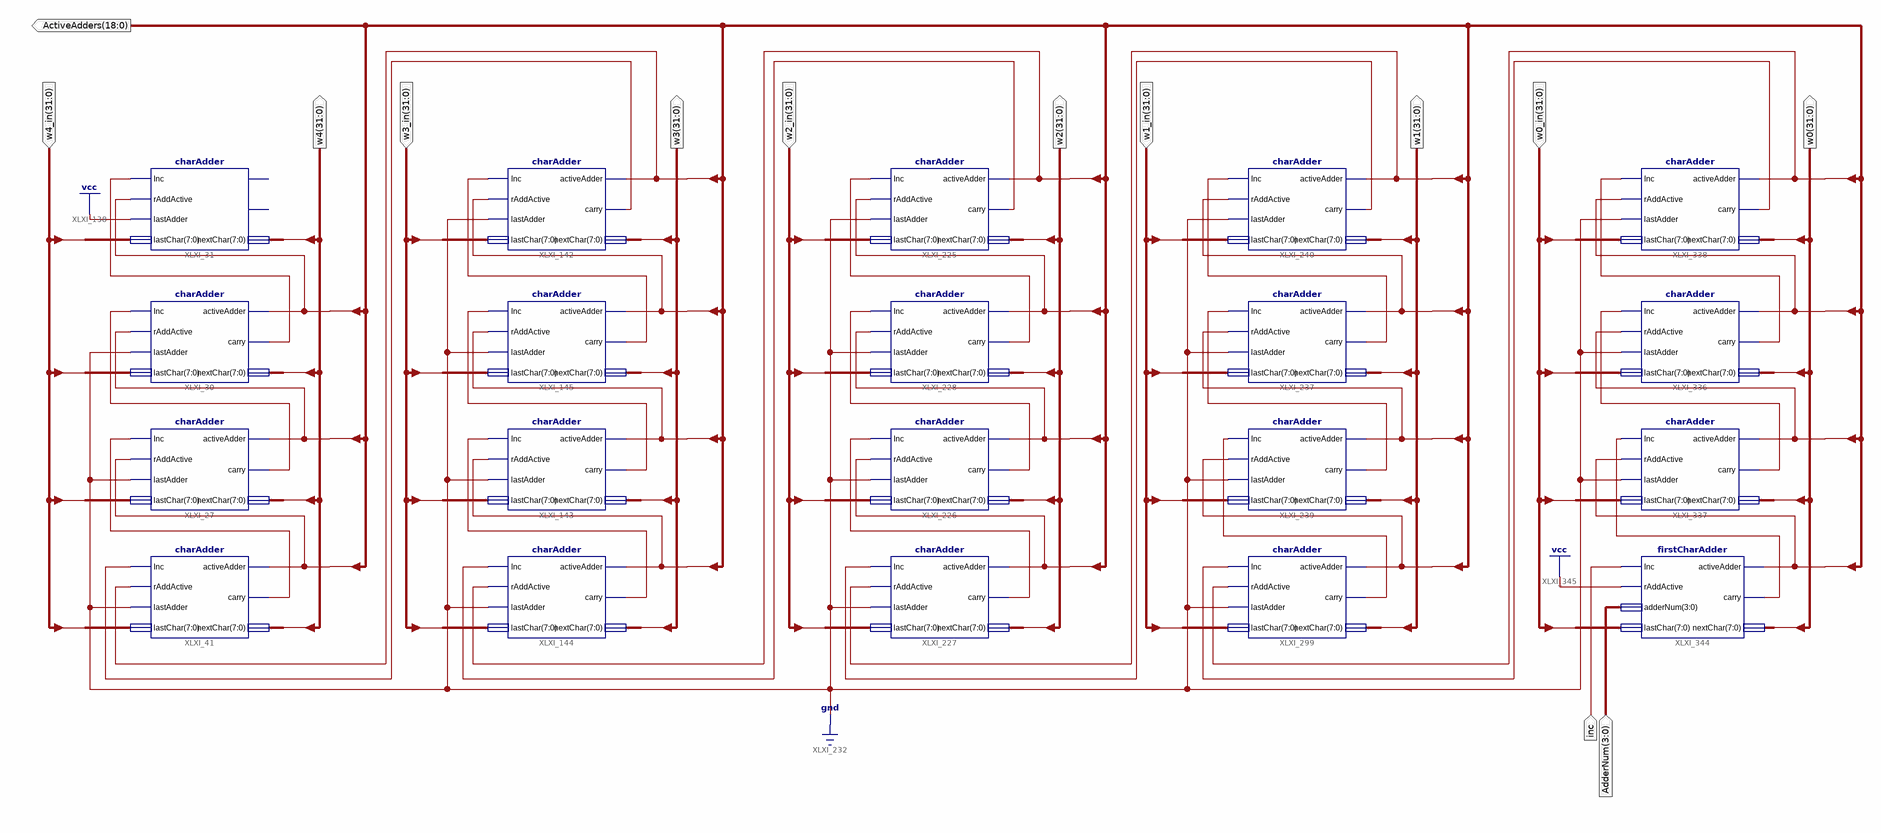
[diagram p0: schematic sheet 1]
// Xilinx ISE schematic bruteforce.sch (spartan3a) as structural Verilog: 20 symbols, 13 ports
module bruteforce (
  input  [31:0] w4_in,
  input  [31:0] w3_in,
  input  [31:0] w2_in,
  input  [31:0] w1_in,
  input  [31:0] w0_in,
  input  inc,
  input  [3:0] AdderNum,
  output [31:0] w4,
  output [31:0] w3,
  output [31:0] w2,
  output [31:0] w1,
  output [31:0] w0,
  output [18:0] ActiveAdders
);

  wire XLXN_10, XLXN_12, XLXN_14, XLXN_38, XLXN_39, XLXN_40, XLXN_168, XLXN_169, XLXN_170, XLXN_191,
       XLXN_192, XLXN_193, XLXN_249, XLXN_251, XLXN_253, XLXN_554, XLXN_555, XLXN_556, XLXN_582;

  charAdder XLXI_31 (
    .Inc(XLXN_10), .rAddActive(ActiveAdders[18]), .lastAdder(1'b1), .lastChar(w4_in[31:24]),
    .nextChar(w4[31:24]));  // open: activeAdder, carry
  charAdder XLXI_27 (
    .Inc(XLXN_14), .rAddActive(ActiveAdders[16]), .lastAdder(1'b0), .lastChar(w4_in[15:8]),
    .activeAdder(ActiveAdders[17]), .carry(XLXN_12), .nextChar(w4[15:8]));
  charAdder XLXI_41 (
    .Inc(XLXN_249), .rAddActive(ActiveAdders[15]), .lastAdder(1'b0), .lastChar(w4_in[7:0]),
    .activeAdder(ActiveAdders[16]), .carry(XLXN_14), .nextChar(w4[7:0]));
  charAdder XLXI_30 (
    .Inc(XLXN_12), .rAddActive(ActiveAdders[17]), .lastAdder(1'b0), .lastChar(w4_in[23:16]),
    .activeAdder(ActiveAdders[18]), .carry(XLXN_10), .nextChar(w4[23:16]));
  charAdder XLXI_145 (
    .Inc(XLXN_39), .rAddActive(ActiveAdders[13]), .lastAdder(1'b0), .lastChar(w3_in[23:16]),
    .activeAdder(ActiveAdders[14]), .carry(XLXN_38), .nextChar(w3[23:16]));
  charAdder XLXI_144 (
    .Inc(XLXN_251), .rAddActive(ActiveAdders[11]), .lastAdder(1'b0), .lastChar(w3_in[7:0]),
    .activeAdder(ActiveAdders[12]), .carry(XLXN_40), .nextChar(w3[7:0]));
  charAdder XLXI_143 (
    .Inc(XLXN_40), .rAddActive(ActiveAdders[12]), .lastAdder(1'b0), .lastChar(w3_in[15:8]),
    .activeAdder(ActiveAdders[13]), .carry(XLXN_39), .nextChar(w3[15:8]));
  charAdder XLXI_142 (
    .Inc(XLXN_38), .rAddActive(ActiveAdders[14]), .lastAdder(1'b0), .lastChar(w3_in[31:24]),
    .activeAdder(ActiveAdders[15]), .carry(XLXN_249), .nextChar(w3[31:24]));
  charAdder XLXI_225 (
    .Inc(XLXN_168), .rAddActive(ActiveAdders[10]), .lastAdder(1'b0), .lastChar(w2_in[31:24]),
    .activeAdder(ActiveAdders[11]), .carry(XLXN_251), .nextChar(w2[31:24]));
  charAdder XLXI_226 (
    .Inc(XLXN_170), .rAddActive(ActiveAdders[8]), .lastAdder(1'b0), .lastChar(w2_in[15:8]),
    .activeAdder(ActiveAdders[9]), .carry(XLXN_169), .nextChar(w2[15:8]));
  charAdder XLXI_227 (
    .Inc(XLXN_253), .rAddActive(ActiveAdders[7]), .lastAdder(1'b0), .lastChar(w2_in[7:0]),
    .activeAdder(ActiveAdders[8]), .carry(XLXN_170), .nextChar(w2[7:0]));
  charAdder XLXI_228 (
    .Inc(XLXN_169), .rAddActive(ActiveAdders[9]), .lastAdder(1'b0), .lastChar(w2_in[23:16]),
    .activeAdder(ActiveAdders[10]), .carry(XLXN_168), .nextChar(w2[23:16]));
  charAdder XLXI_237 (
    .Inc(XLXN_192), .rAddActive(ActiveAdders[5]), .lastAdder(1'b0), .lastChar(w1_in[23:16]),
    .activeAdder(ActiveAdders[6]), .carry(XLXN_193), .nextChar(w1[23:16]));
  charAdder XLXI_239 (
    .Inc(XLXN_191), .rAddActive(ActiveAdders[4]), .lastAdder(1'b0), .lastChar(w1_in[15:8]),
    .activeAdder(ActiveAdders[5]), .carry(XLXN_192), .nextChar(w1[15:8]));
  charAdder XLXI_240 (
    .Inc(XLXN_193), .rAddActive(ActiveAdders[6]), .lastAdder(1'b0), .lastChar(w1_in[31:24]),
    .activeAdder(ActiveAdders[7]), .carry(XLXN_253), .nextChar(w1[31:24]));
  charAdder XLXI_299 (
    .Inc(XLXN_582), .rAddActive(ActiveAdders[3]), .lastAdder(1'b0), .lastChar(w1_in[7:0]),
    .activeAdder(ActiveAdders[4]), .carry(XLXN_191), .nextChar(w1[7:0]));
  charAdder XLXI_336 (
    .Inc(XLXN_555), .rAddActive(ActiveAdders[1]), .lastAdder(1'b0), .lastChar(w0_in[23:16]),
    .activeAdder(ActiveAdders[2]), .carry(XLXN_556), .nextChar(w0[23:16]));
  charAdder XLXI_337 (
    .Inc(XLXN_554), .rAddActive(ActiveAdders[0]), .lastAdder(1'b0), .lastChar(w0_in[15:8]),
    .activeAdder(ActiveAdders[1]), .carry(XLXN_555), .nextChar(w0[15:8]));
  charAdder XLXI_338 (
    .Inc(XLXN_556), .rAddActive(ActiveAdders[2]), .lastAdder(1'b0), .lastChar(w0_in[31:24]),
    .activeAdder(ActiveAdders[3]), .carry(XLXN_582), .nextChar(w0[31:24]));
  firstCharAdder XLXI_344 (
    .Inc(inc), .rAddActive(1'b1), .adderNum(AdderNum), .lastChar(w0_in[7:0]), .activeAdder(ActiveAdders[0]),
    .carry(XLXN_554), .nextChar(w0[7:0]));
endmodule
